# EAGLE design CAN Star (EAGLE 9.3.1)
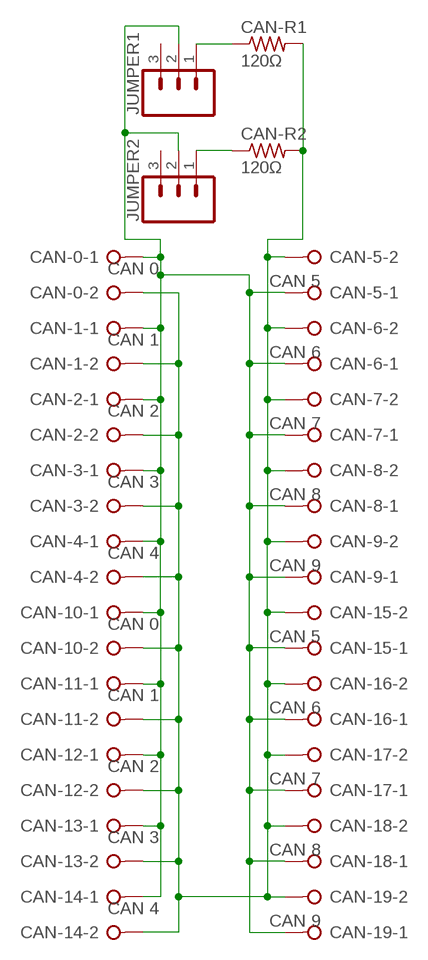
[diagram p0: schematic, sheet 1]

## Parts
CAN-0  CAN 0  W237-02P  [W237-132]
CAN-1  CAN 1  W237-02P  [W237-132]
CAN-2  CAN 2  W237-02P  [W237-132]
CAN-3  CAN 3  W237-02P  [W237-132]
CAN-4  CAN 4  W237-02P  [W237-132]
CAN-5  CAN 5  W237-02P  [W237-132]
CAN-6  CAN 6  W237-02P  [W237-132]
CAN-7  CAN 7  W237-02P  [W237-132]
CAN-8  CAN 8  W237-02P  [W237-132]
CAN-9  CAN 9  W237-02P  [W237-132]
CAN-10  CAN 0  W237-02P  [W237-132]
CAN-11  CAN 1  W237-02P  [W237-132]
CAN-12  CAN 2  W237-02P  [W237-132]
CAN-13  CAN 3  W237-02P  [W237-132]
CAN-14  CAN 4  W237-02P  [W237-132]
CAN-15  CAN 5  W237-02P  [W237-132]
CAN-16  CAN 6  W237-02P  [W237-132]
CAN-17  CAN 7  W237-02P  [W237-132]
CAN-18  CAN 8  W237-02P  [W237-132]
CAN-19  CAN 9  W237-02P  [W237-132]
CAN-R1  120Ω  R-US_0207/10  [0207/10]
CAN-R2  120Ω  R-US_0207/10  [0207/10]
JUMPER1  CONN_03  [1X03]
JUMPER2  CONN_03  [1X03]

## Nets
CAN-A: CAN-0.1 CAN-1.1 CAN-2.1 CAN-3.1 CAN-4.1 CAN-5.1 CAN-6.1 CAN-7.1 CAN-8.1 CAN-9.1 CAN-10.1 CAN-11.1 CAN-12.1 CAN-13.1 CAN-14.1 CAN-15.1 CAN-16.1 CAN-17.1 CAN-18.1 CAN-19.1 JUMPER1.2 JUMPER2.2
CAN-B: CAN-0.2 CAN-1.2 CAN-2.2 CAN-3.2 CAN-4.2 CAN-5.2 CAN-6.2 CAN-7.2 CAN-8.2 CAN-9.2 CAN-10.2 CAN-11.2 CAN-12.2 CAN-13.2 CAN-14.2 CAN-15.2 CAN-16.2 CAN-17.2 CAN-18.2 CAN-19.2 CAN-R1.2 CAN-R2.2
N$1: CAN-R1.1 JUMPER1.1
N$2: CAN-R2.1 JUMPER2.1
Unconnected: JUMPER1.3 JUMPER2.3

## Library data of the parts
CAN-0 CAN-1-CAN-19 = con-wago-508:W237-02P: WAGO SREW CLAMP; OC_FARNELL: unknown; OC_NEWARK: unknown
CAN-R1 CAN-R2 = resistor:R-US_: RESISTOR, American symbol
JUMPER1 JUMPER2 = SparkFun-Connectors:CONN_03: Multi connection point. Often used as Generic Header-pin footprint for 0.1 inch spaced/style header connections On any of the 0.1 inch spaced packages, you can populate with these: Break Away Headers - Straight <https://www.sparkfun.com/products/116> (PRT-00116) Break Away Male Headers - Right Angle <https://www.sparkfun.com/products/553> (PRT-00553) Female Headers <https://www.sparkfun.com/products/115> (PRT-00115) Break Away Headers - Machine Pin <https://www.sparkfun.com/products/117> (PRT-00117) Break Away Female Headers - Swiss Machine Pin <https://www.sparkfun.com/products/743> (PRT-00743) Stackable Header - 3 Pin (Female, 0.1") <https://www.sparkfun.com/products/13875> (PRT-13875) For SCREWTERMINALS and SPRING TERMINALS visit here: Screw Terimnals on SparkFun.com <https://www.sparkfun.com/search/results?term=Screw+Terminals> (5mm/3.5mm/2.54mm spacing) This device is also useful as a general connection point to wire up your design to another part of your project. Our various solder wires solder well into these plated through hole pads. Hook-Up Wire - Assortment (Stranded, 22 AWG) <https://www.sparkfun.com/products/11375> (PRT-11375) Hook-Up Wire - Assortment (Solid Core, 22 AWG) <https://www.sparkfun.com/products/11367> (PRT-11367) View the entire wire category on our website here <https://www.sparkfun.com/categories/141> Special notes: Molex polarized connector foot print use with SKU : PRT-08232 with associated crimp pins and housings.

## Board
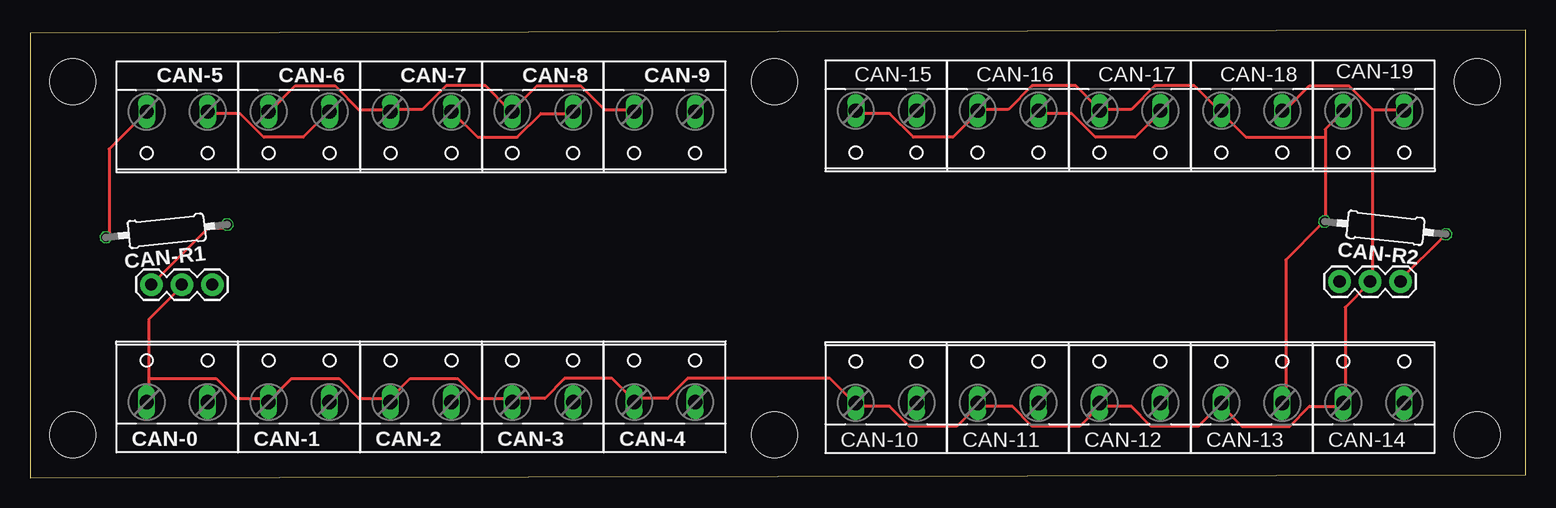
[diagram p1: board, top side]
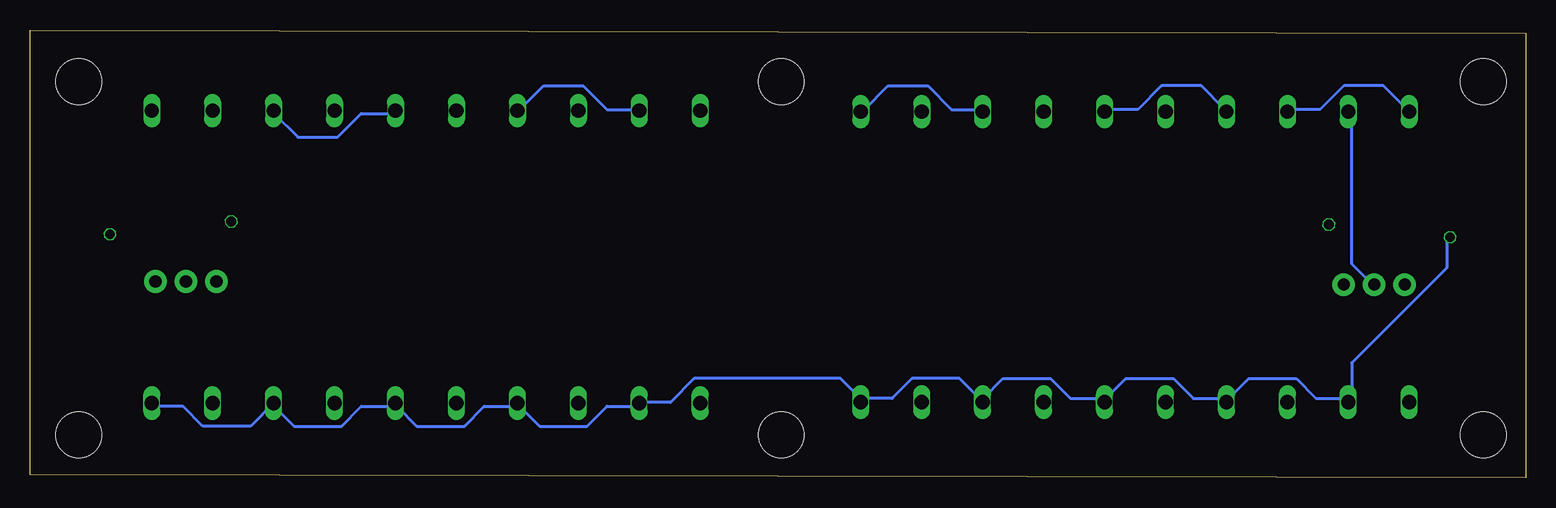
[diagram p2: board, bottom side, seen from below]

Size 124.7 x 37.34 mm. Coordinates in mm from the lower left corner, seen from the top.
Outline: 0,0 124.7,0.25 124.7,37.34 0,37.08 0,0
Copper layers (1*16): Top 0.0356mm / dielectric 1.5011mm / Bottom 0.0356mm
Design rules "SilverCircuits *": minimum track width 10mil, minimum drill 15mil, track to track 16mil, track to pad 16mil, pad to pad 16mil, via to via 16mil, smd to smd 0mil, copper to edge 20mil, drill to drill 20mil, minimum pad ring 4mil, minimum via ring 8mil, stop-mask expansion 4mil, vias tented up to drill 0mil, thermal gap 10mil
Holes 3.81 mm at 3.56,33.02 3.56,3.56 62.08,3.56 62.08,33.02 120.65,33.02 120.65,3.56

### Footprints (pad centres in the part's own frame; a part is rotated, then mirrored left to right if it is on the bottom)
W237-132 = drill 1.194 long: 1 -2.54,-0.635; 2 2.54,-0.635
0207/10 = drill 0.813 octagon: 1 -5.08,0; 2 5.08,0
1X03 = drill 1.016 pad 1.88: 1 0,0; 2 2.54,0; 3 5.08,0

### Placement (x,y rotation side)
CAN-0  12.27,6.93 0 top
CAN-1  22.43,6.93 0 top
CAN-2  32.59,6.93 0 top
CAN-3  42.75,6.93 0 top
CAN-4  52.91,6.93 0 top
CAN-5  12.27,29.9 180 top
CAN-6  22.43,29.9 180 top
CAN-7  32.59,29.9 180 top
CAN-8  42.75,29.9 180 top
CAN-9  52.91,29.9 180 top
CAN-10  71.37,6.86 0 top
CAN-11  81.53,6.86 0 top
CAN-12  91.69,6.86 0 top
CAN-13  101.85,6.86 0 top
CAN-14  112.01,6.86 0 top
CAN-15  71.37,29.97 180 top
CAN-16  81.53,29.97 180 top
CAN-17  91.69,29.97 180 top
CAN-18  101.85,29.97 180 top
CAN-19  112.01,29.97 180 top
CAN-R1  11.38,20.57 186 top
CAN-R2  112.98,20.83 174 top
JUMPER1  10.11,16.1 0 top
JUMPER2  114.25,16.36 180 top

### Tracks (layer width: path | path; a pad name or v marks a point on that pad's centre or on a via)
CAN-A
  Top 0.254: CAN-5.1 14.86,30.38 17.5,30.38 19.48,28.4 22.78,28.4 24.77,30.38 CAN-6.1 | CAN-8.1 45.24,30.38 42.6,30.38 40.62,28.4 37.31,28.4 35.33,30.38 CAN-7.1 | 9.91,8.26 9.91,13.21 12.55,15.85 JUMPER1.2 | 9.91,8.26 9.91,6.6 CAN-0.1 | 9.91,8.26 15.52,8.26 17.17,6.6 19.81,6.6 CAN-1.1 20.14,6.6 21.79,8.26 25.76,8.26 27.41,6.6 30.05,6.6 | 30.05,6.6 31.7,8.26 35.66,8.26 37.31,6.6 39.95,6.6 CAN-3.1 40.28,6.6 42.93,6.6 44.58,8.26 48.54,8.26 50.19,6.6 CAN-4.1 50.52,6.6 53.16,6.6 54.81,8.26 66.7,8.26 68.68,6.27 CAN-10.1 69.01,5.94 71.65,5.94 73.3,4.29 77.27,4.29 78.92,5.94 CAN-11.1 79.25,5.94 81.89,5.94 83.54,4.29 87.5,4.29 89.15,5.94 | 30.05,6.6 CAN-2.1 | 111.94,30.71 114.25,30.71 CAN-19.1 | 111.94,30.71 109.96,32.69 106.66,32.69 104.67,30.71 CAN-18.1 | CAN-16.1 84.2,30.38 86.84,30.38 88.82,28.4 92.13,28.4 94.11,30.38 CAN-17.1 | 89.15,5.94 91.8,5.94 93.45,4.29 97.41,4.29 99.06,5.94 CAN-13.1 99.39,5.94 101.04,4.29 105,4.29 106.66,5.94 109.3,5.94 CAN-14.1 109.63,6.27 109.63,14.2 111.61,16.18 JUMPER2.2 111.94,16.51 111.94,30.71 | 89.15,5.94 CAN-12.1
  Bottom 0.254: CAN-8.1 45.57,30.71 47.88,30.71 49.86,32.69 53.16,32.69 55.14,30.71 CAN-9.1 | CAN-7.1 35,30.71 32.36,30.71 30.38,32.69 27.08,32.69 25.09,30.71 CAN-6.1 | CAN-5.1 14.53,30.38 14.53,17.83 12.88,16.18 JUMPER1.2 | CAN-15.1 73.97,30.71 76.61,30.71 78.59,32.69 81.89,32.69 83.87,30.71 CAN-16.1 | CAN-17.1 94.44,30.38 97.08,30.38 99.06,28.4 102.36,28.4 104.34,30.38 CAN-18.1
CAN-B
  Top 0.254: CAN-15.2 69.01,30.38 71.65,30.38 73.64,28.4 76.94,28.4 78.92,30.38 CAN-16.2 79.25,30.71 81.56,30.71 83.54,32.69 87.17,32.69 89.15,30.71 | 107.97,28.4 107.97,29.06 109.3,30.38 CAN-19.2 | 107.97,28.4 107.97,21.46 CAN-R2.2 107.64,21.13 104.67,18.16 104.67,6.27 CAN-13.2 | 89.15,30.71 91.8,30.71 93.78,32.69 97.08,32.69 99.06,30.71 CAN-18.2 99.39,30.38 101.37,28.4 107.97,28.4 | 89.15,30.71 CAN-17.2 | 30.05,30.71 32.69,30.71 34.67,32.69 37.97,32.69 39.95,30.71 CAN-8.2 40.28,30.71 42.27,32.69 45.9,32.69 47.88,30.71 50.19,30.71 CAN-9.2 | CAN-5.2 6.6,27.41 6.6,20.14 CAN-R1.2 | 30.05,30.71 27.41,30.71 25.43,32.69 22.12,32.69 20.14,30.71 CAN-6.2 | 30.05,30.71 CAN-7.2
  Bottom 0.254: CAN-14.2 114.25,5.94 111.94,5.94 110.29,4.29 106.32,4.29 CAN-13.2 104.34,5.94 102.69,4.29 98.73,4.29 97.08,5.94 94.44,5.94 CAN-12.2 94.11,5.94 92.46,4.29 88.49,4.29 86.84,5.94 84.2,5.94 CAN-11.2 83.87,5.94 82.22,4.29 78.26,4.29 76.61,5.94 73.97,5.94 CAN-10.2 73.64,6.27 71.32,6.27 69.34,8.26 57.12,8.26 55.47,6.6 CAN-4.2 55.14,6.6 52.83,6.6 51.18,8.26 47.22,8.26 45.57,6.6 CAN-3.2 45.24,6.6 43.59,8.26 39.62,8.26 37.97,6.6 35.33,6.6 CAN-2.2 35,6.6 33.35,8.26 29.39,8.26 27.74,6.6 25.09,6.6 CAN-1.2 24.77,6.6 23.11,8.26 19.15,8.26 17.5,6.6 14.86,6.6 CAN-0.2 14.53,6.6 14.53,9.58 6.6,17.5 6.6,19.81 CAN-R1.2 | CAN-5.2 11.89,32.69 15.19,32.69 17.17,30.71 19.81,30.71 CAN-6.2
N$1
  Top 0.254: CAN-R1.1 16.18,20.8 14.86,20.8 10.24,16.18 JUMPER1.1
N$2
  Top 0.254: CAN-R2.1 117.88,20.14 114.25,16.51 JUMPER2.1

### Text on the board
tValues: Y(H) | G(L) | Y(H) | G(L) | Y(H) | G(L) | Y(H) | G(L) | Y(H) | G(L) | Y(H) | G(L) | Y(H) | G(L) | Y(H) | G(L) | Y(H) | G(L) | Y(H) | G(L) | Star Board Wide v8 | RoboLoCo / Team 5338 | ON | https://www.roboloco.org/canpcb | ON | G(L) | Y(H) | G(L) | Y(H) | G(L) | Y(H) | G(L) | Y(H) | G(L) | Y(H) | G(L) | Y(H) | G(L) | Y(H) | G(L) | Y(H) | G(L) | Y(H) | G(L) | Y(H)